# EAGLE schematic Chasiss1.1 (EAGLE 9.6.2)
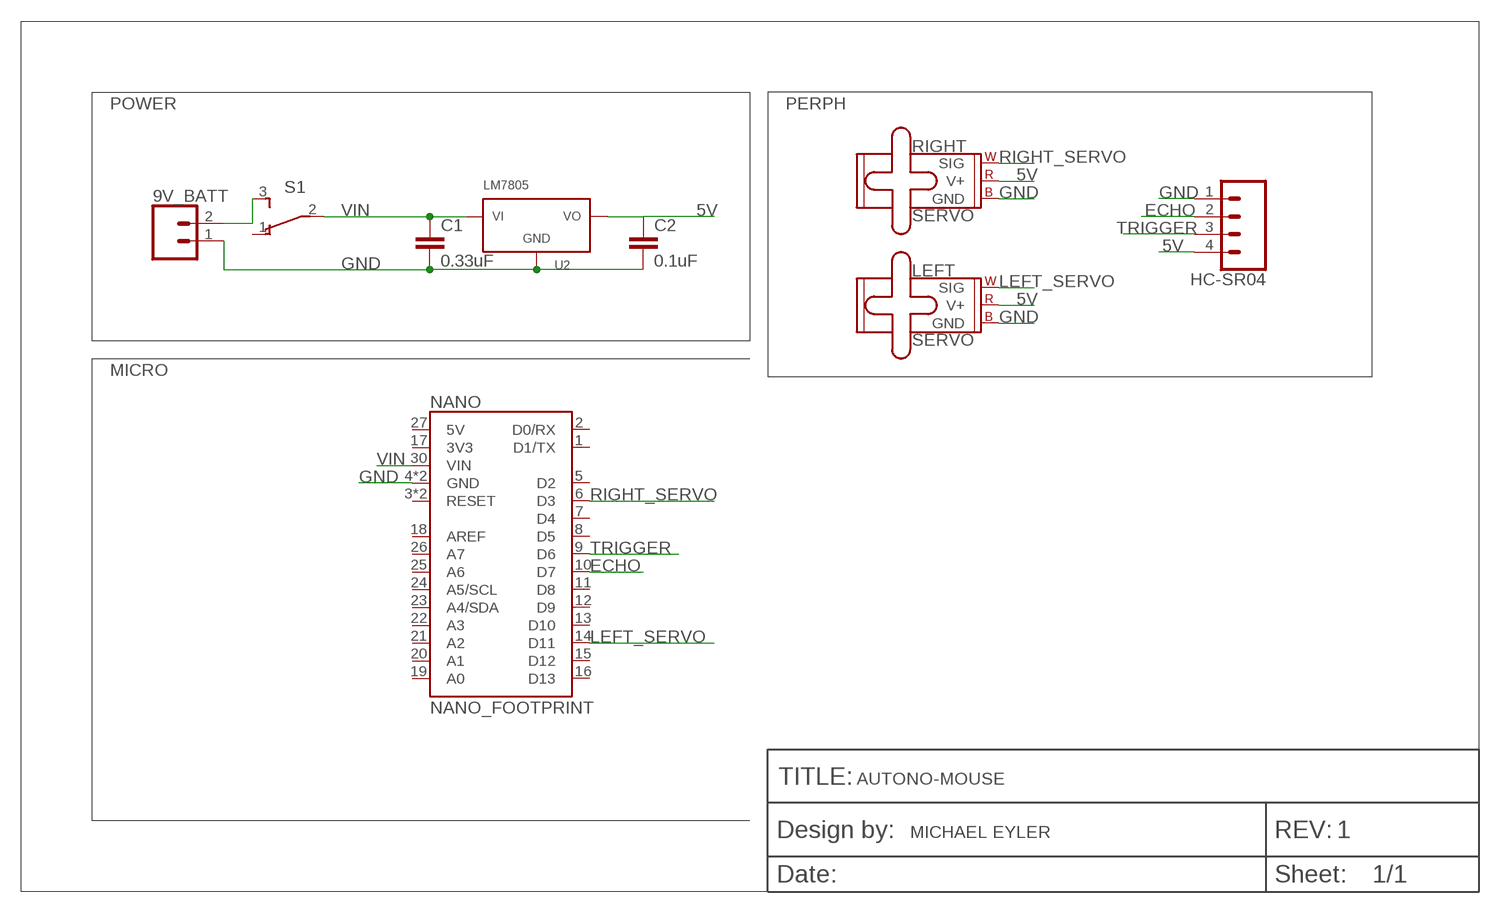
[diagram p0: schematic, sheet 1]

## Parts
9V_BATT  CONN_02  [1X02]
C1  0.33uF  0.1UF-KIT-EZ-50V-20%  [CAP-PTH-SMALL-KIT]
C2  0.1uF  0.1UF-KIT-EZ-50V-20%  [CAP-PTH-SMALL-KIT]
HC-SR04  CONN_04PTH  [1X04]
LEFT  SERVO  [1X03]
NANO  NANO_FOOTPRINT  [NANO]
RIGHT  SERVO  [1X03]
S1  TL36PO  [TL3XPO]
U2  LM7805  [TO220H]
U$1  FRAME-BADGE  [DUMMY]

## Nets
5V: C2.1 HC-SR04.4 LEFT.2(V+) RIGHT.2(V+) U2.3(VOUT)
ECHO: HC-SR04.2 NANO.10(D7)
GND: 9V_BATT.1 C1.2 C2.2 HC-SR04.1 LEFT.3(GND) NANO.4(GND) NANO.29(GND) RIGHT.3(GND) U2.2(GND)
LEFT_SERVO: LEFT.1(SIG) NANO.14(D11)
N$1: 9V_BATT.2 S1.3(S)
RIGHT_SERVO: NANO.6(D3) RIGHT.1(SIG)
TRIGGER: HC-SR04.3 NANO.9(D6)
VIN: C1.1 NANO.30(VIN) S1.2(P) U2.1(VIN)
Unconnected: NANO.1(D1/TX) NANO.2(D0/RX) NANO.3(RESET) NANO.5(D2) NANO.7(D4) NANO.8(D5) NANO.11(D8) NANO.12(D9) NANO.13(D10) NANO.15(D12) NANO.16(D13) NANO.17(3V3) NANO.18(AREF) NANO.19(A0) NANO.20(A1) NANO.21(A2) NANO.22(A3) NANO.23(A4/SDA) NANO.24(A5/SCL) NANO.25(A6) NANO.26(A7) NANO.27(5V) NANO.28(RESET) S1.1(O)

## Notes on the sheet
- POWER | PERPH
- MICRO
- AUTONO-MOUSE
- MICHAEL EYLER | 1

## Library data of the parts
9V_BATT = SparkFun-Connectors:CONN_02: Multi connection point. Often used as Generic Header-pin footprint for 0.1 inch spaced/style header connections On any of the 0.1 inch spaced packages, you can populate with these: Break Away Headers - Straight <https://www.sparkfun.com/products/116> (PRT-00116) Break Away Male Headers - Right Angle <https://www.sparkfun.com/products/553> (PRT-00553) Female Headers <https://www.sparkfun.com/products/115> (PRT-00115) Break Away Headers - Machine Pin <https://www.sparkfun.com/products/117> (PRT-00117) Break Away Female Headers - Swiss Machine Pin <https://www.sparkfun.com/products/743> (PRT-00743) For SCREWTERMINALS and SPRING TERMINALS visit here: Screw Terimnals on SparkFun.com <https://www.sparkfun.com/search/results?term=Screw+Terminals> (5mm/3.5mm/2.54mm spacing) This device is also useful as a general connection point to wire up your design to another part of your project. Our various solder wires solder well into these plated through hole pads. Hook-Up Wire - Assortment (Stranded, 22 AWG) <https://www.sparkfun.com/products/11375> (PRT-11375) Hook-Up Wire - Assortment (Solid Core, 22 AWG) <https://www.sparkfun.com/products/11367> (PRT-11367) View the entire wire category on our website here <https://www.sparkfun.com/categories/141> Special notes: Molex polarized connector foot print use with: PRT-08233 with associated crimp pins and housings. 2.54_SCREWTERM for use with PRT-10571. 3.5mm Screw Terminal footprints for PRT-08084 5mm Screw Terminal footprints for use with PRT-08432
C1 = SparkFun-Capacitors:0.1UF: 0.1µF ceramic capacitors A capacitor is a passive two-terminal electrical component used to store electrical energy temporarily in an electric field.; PROD_ID: CAP-08370; VALUE: 0.1uF
C2 = SparkFun-Capacitors:0.1UF: 0.1µF ceramic capacitors A capacitor is a passive two-terminal electrical component used to store electrical energy temporarily in an electric field.; PROD_ID: CAP-08370
HC-SR04 = SparkFun-Connectors:CONN_04: Multi connection point. Often used as Generic Header-pin footprint for 0.1 inch spaced/style header connections On any of the 0.1 inch spaced packages, you can populate with these: Break Away Headers - Straight <https://www.sparkfun.com/products/116> (PRT-00116) Break Away Male Headers - Right Angle <https://www.sparkfun.com/products/553> (PRT-00553) Female Headers <https://www.sparkfun.com/products/115> (PRT-00115) Break Away Headers - Machine Pin <https://www.sparkfun.com/products/117> (PRT-00117) Break Away Female Headers - Swiss Machine Pin <https://www.sparkfun.com/products/743> (PRT-00743) For SCREWTERMINALS and SPRING TERMINALS visit here: Screw Terimnals on SparkFun.com <https://www.sparkfun.com/search/results?term=Screw+Terminals> (5mm/3.5mm/2.54mm spacing) This device is also useful as a general connection point to wire up your design to another part of your project. Our various solder wires solder well into these plated through hole pads. Hook-Up Wire - Assortment (Stranded, 22 AWG) <https://www.sparkfun.com/products/11375> (PRT-11375) Hook-Up Wire - Assortment (Solid Core, 22 AWG) <https://www.sparkfun.com/products/11367> (PRT-11367) View the entire wire category on our website here <https://www.sparkfun.com/categories/141> Special notes: Molex polarized connector foot print use with SKU : PRT-08231 with associated crimp pins and housings. 1MM SMD Version SKU: PRT-10208; PROD_ID: CONN-09696
LEFT RIGHT = SparkFun-Electromechanical:SERVO: Servo Motor 3-pin connector for a standard servo motor (voltage supply, ground, and control signal.) SparkFun Products Servo - Generic (Sub-Micro Size) <https://www.sparkfun.com/products/9065> (ROB-09065) Servo - Generic High Torque Continuous Rotation (Standard Size) <https://www.sparkfun.com/products/9347> (ROB-09347) Servo - Generic High Torque (Standard Size) <https://www.sparkfun.com/products/11965> (ROB-11965)
NANO = SparkFun-Boards:NANO_FOOTPRINT: Generic Nano Footprint
S1 = switch:TL36PO: TINY SWITCH ON - ON Source: http://www2.produktinfo.conrad.com/datenblaetter/700000-724999/705152-da-01-de-Subminiaturschalter_TL_36YO.pdf
U2 = class-parts:LM7805
U$1 = AndysLib:FRAME-BADGE